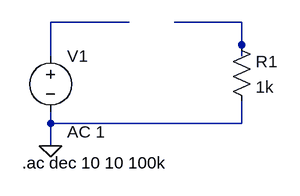
[diagram p0: schematic RL_charging _discharging.asc]
RL_charging _discharging.asc, the LTspice schematic file:
Version 4.1
SHEET 1 880 680
WIRE 176 128 64 128
WIRE 336 128 240 128
WIRE 336 160 336 128
WIRE 64 176 64 128
WIRE 336 176 336 160
WIRE 64 272 64 256
WIRE 336 272 336 240
WIRE 336 272 64 272
WIRE 64 304 64 272
FLAG 64 304 0
SYMBOL res 320 144 R0
SYMATTR InstName R1
SYMATTR Value 1k
SYMBOL voltage 64 160 R0
WINDOW 123 24 124 Left 2
WINDOW 39 0 0 Left 0
SYMATTR Value2 AC 1
SYMATTR InstName V1
SYMATTR Value ""
TEXT 24 328 Left 2 !.ac dec 10 10 100k

The netlist it stands for:
* RL_charging _discharging.asc
R1 N002 0 1k
V1 N001 0 AC 1
.ac dec 10 10 100k
.backanno
.end